# Altium schematic sheet voltagesumsource.SchDoc: VOLTAGE SUM SOURCE
size A4; Organization: Altium Limited; Address1: L3, 12a Rodborough Rd; Address2: Frenchs Forest; Address3: NSW; Address4: Australia 2086
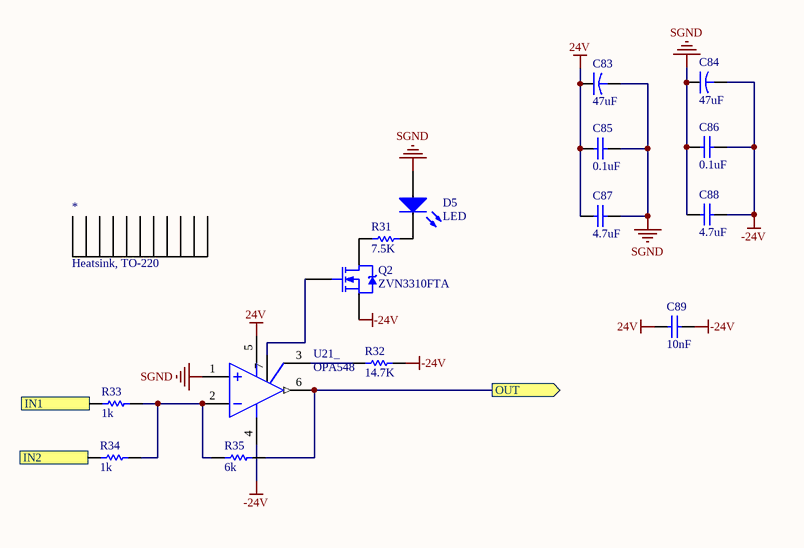
[diagram p0: voltagesumsource.SchDoc]

## Parts
*  Heatsink, TO-220
C83  47uF  [UCY2C470MPD]
C84  47uF  [UCY2C470MPD]
C85  0.1uF  [STD_0805_C]
C86  0.1uF  [STD_0805_C]
C87  4.7uF  [STD_0805_C]
C88  4.7uF  [STD_0805_C]
C89  10nF  [STD_0805_C]
D5  LED  [STD_LED]
Q2  ZVN3310FTA  [SOT-23B_M]
R31  7.5K  [STD_0805_R]
R32  14.7K  [STD_0805_R]
R33  1k  [STD_0805_R]
R34  1k  [STD_0805_R]
R35  6k  [STD_0805_R]
U21_  OPA548  [TO-220-7]

## Ports
IN1 (in), IN2 (in), OUT (out)

## Nets
24V: C83.1 C85.1 C87.1 C89.1 U21_.5(V+)
-24V: C84.2 C86.2 C88.2 C89.2 Q2.3(S) R32.2 U21_.4(V-)
SGND: C83.2 C84.1 C85.2 C86.1 C87.2 C88.1 D5.1 U21_.1(IN-)
IN1: R33.1 ; port IN1
IN2: R34.1 ; port IN2
OUT: R35.2 U21_.6(OUT) ; port OUT
NetD5_2: D5.2 R31.2
NetQ2_1: Q2.1(G) U21_.7(OS_NUL)
NetQ2_2: Q2.2(D) R31.1
NetR32_1: R32.1 U21_.3(TAB)
NetR33_2: R33.2 R34.2 R35.1 U21_.2(IN+)

## Notes on the sheet
- Title
- Date:
- RE:
- Arturo di Girolamo
- Size:
- A3
- A

## Library data of the parts
* = 6399BG: Heavy duty heatsink; MFGPN: 6399BG
C83 C84 = UCY2C470MPD: Capacitor, 47uF NICHICON; MFGPN: UCY2C470MPD
C85 C86 = CL21B104KACNNNC: Capacitor, 0.1uF, 0805; Value: .01uf; MFGPN: CL21B104KACNNNC
C87 C88 = CL21A475KAQNNNE: Capacitor, 4.7uF, 0805; Value: .01uf; MFGPN: CL21A475KAQNNNE
C89 = C0805C103K1RAC7210: Capacitor, 10nF, 0805; Value: .01uf; MFGPN: C0805C103K1RAC7210
D5 = LNJ037X8ARA: Typical LED; MFGPN: LNJ037X8ARA
Q2 = ZVN3310FTA: N-Channel Power MOSFET; ComponentLink1Description: Manufacturer Link; ComponentLink1URL: http://www.irf.com/; MFGPN: ZVN3310FTA
R31 = ERJ-PB6D7501V: 7.5K 1% 1/4W; Value: 1K; MFGPN: ERJ-PB6D7501V
R32 = RC0805FR-0714K7L: 14.7K 1% 1/4W; Value: 1K; MFGPN: RC0805FR-0714K7L
R33 R34 = RNCP0805FTD1K00: 1K 1% 1/4W; Value: 1K; MFGPN: RNCP0805FTD1K00
R35 = RMCF0805FT5K60: 6K 1% 1/4W; Value: 6k; MFGPN: RMCF0805FT5K60
U21_ = OPA548T: High power op amp; MFGPN: OPA548T